# EAGLE schematic Expansion_01 (EAGLE 7.5.0)
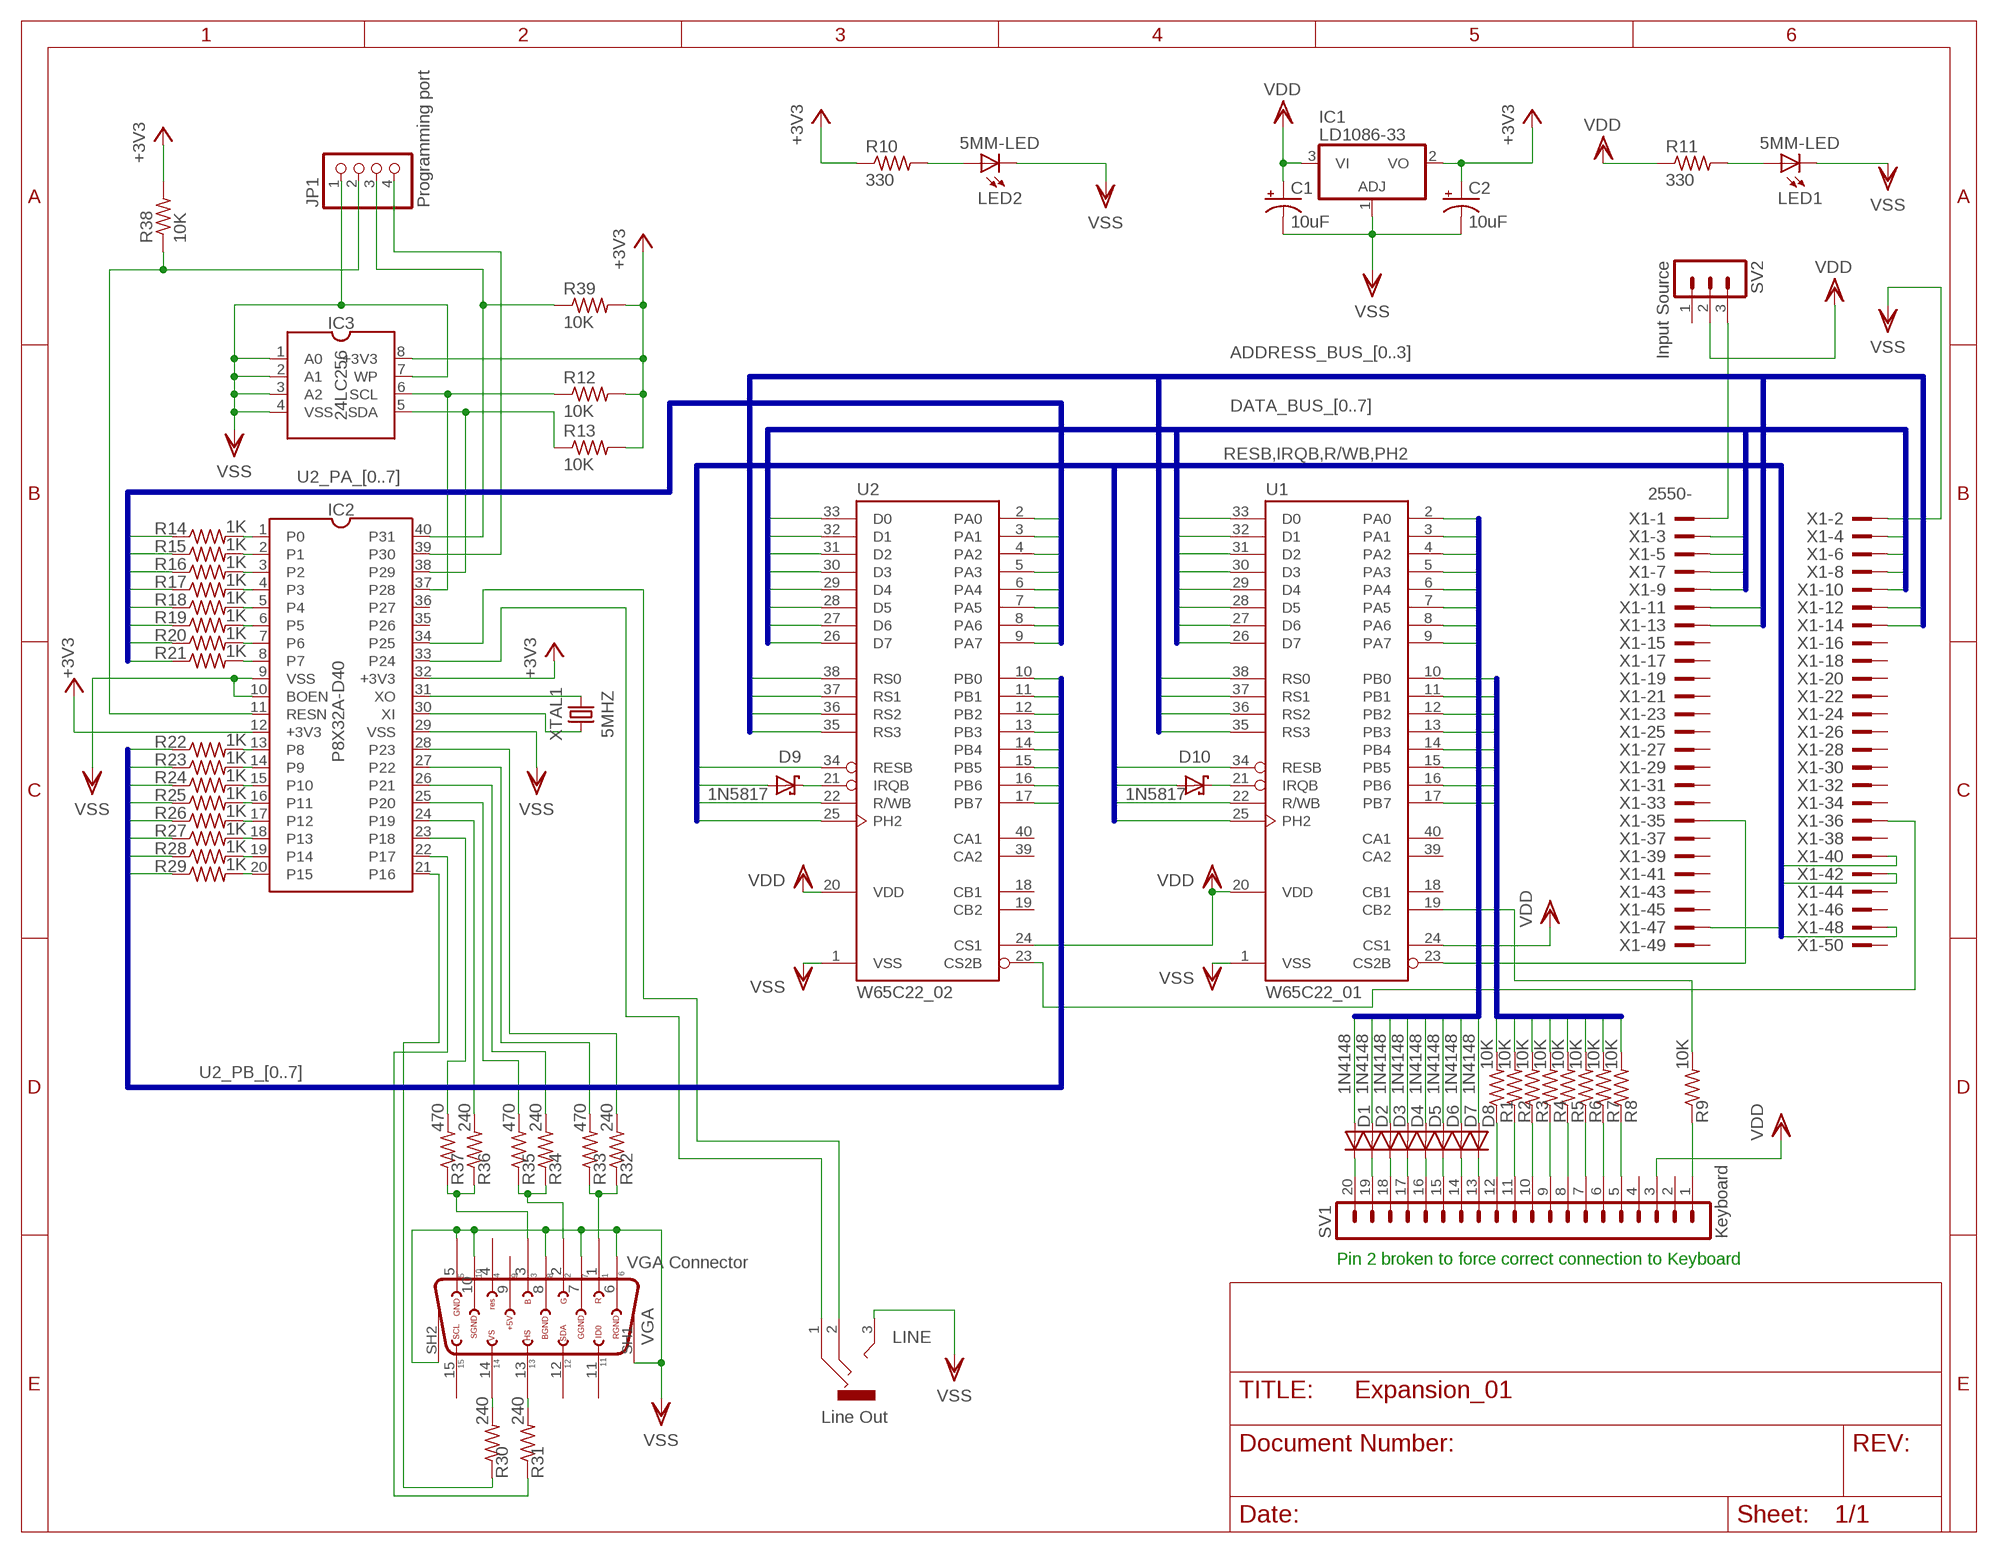
[diagram p0: schematic, sheet 1]

## Parts
C1  10uF  CPOL-USE2-5  [E2-5]
C2  10uF  CPOL-USE2-5  [E2-5]
D1  1N4148  1N4148DO35-7  [DO35-7]
D2  1N4148  1N4148DO35-7  [DO35-7]
D3  1N4148  1N4148DO35-7  [DO35-7]
D4  1N4148  1N4148DO35-7  [DO35-7]
D5  1N4148  1N4148DO35-7  [DO35-7]
D6  1N4148  1N4148DO35-7  [DO35-7]
D7  1N4148  1N4148DO35-7  [DO35-7]
D8  1N4148  1N4148DO35-7  [DO35-7]
D9  1N5817  1N5817-B  [DO41-7.6]
D10  1N5817  1N5817-B  [DO41-7.6]
IC1  LD1086-33  317T  [TO220H]
IC2  P8X32A-D40DIP-40  [P8X32A-D40]
IC3  24LC256DIP-8  [24LC256]
JP1  Programming port  PINHD-1X4/90  [1X04/90]
LED1  5MM-LED  [5MM-LED]
LED2  5MM-LED  [5MM-LED]
LINE  Line Out  1503_04  [1503_04]
R1  10K  R-US_0207/10  [0207/10]
R2  10K  R-US_0207/10  [0207/10]
R3  10K  R-US_0207/10  [0207/10]
R4  10K  R-US_0207/10  [0207/10]
R5  10K  R-US_0207/10  [0207/10]
R6  10K  R-US_0207/10  [0207/10]
R7  10K  R-US_0207/10  [0207/10]
R8  10K  R-US_0207/10  [0207/10]
R9  10K  R-US_0207/10  [0207/10]
R10  330  R-US_0207/10  [0207/10]
R11  330  R-US_0207/10  [0207/10]
R12  10K  R-US_0207/10  [0207/10]
R13  10K  R-US_0207/10  [0207/10]
R14  1K  R-US_0207/10  [0207/10]
R15  1K  R-US_0207/10  [0207/10]
R16  1K  R-US_0207/10  [0207/10]
R17  1K  R-US_0207/10  [0207/10]
R18  1K  R-US_0207/10  [0207/10]
R19  1K  R-US_0207/10  [0207/10]
R20  1K  R-US_0207/10  [0207/10]
R21  1K  R-US_0207/10  [0207/10]
R22  1K  R-US_0207/10  [0207/10]
R23  1K  R-US_0207/10  [0207/10]
R24  1K  R-US_0207/10  [0207/10]
R25  1K  R-US_0207/10  [0207/10]
R26  1K  R-US_0207/10  [0207/10]
R27  1K  R-US_0207/10  [0207/10]
R28  1K  R-US_0207/10  [0207/10]
R29  1K  R-US_0207/10  [0207/10]
R30  240  R-US_0207/10  [0207/10]
R31  240  R-US_0207/10  [0207/10]
R32  240  R-US_0207/10  [0207/10]
R33  470  R-US_0207/10  [0207/10]
R34  240  R-US_0207/10  [0207/10]
R35  470  R-US_0207/10  [0207/10]
R36  240  R-US_0207/10  [0207/10]
R37  470  R-US_0207/10  [0207/10]
R38  10K  R-US_0207/10  [0207/10]
R39  10K  R-US_0207/10  [0207/10]
SV1  Keyboard  MA20-1  [MA20-1]
SV2  Input Source  MA03-1  [MA03-1]
U1  W65C22_01  G65SC22P  [DIP-40]
U2  W65C22_02  G65SC22P  [DIP-40]
VGA  VGA Connector  VGAF  [HD15F]
X1  2550-  [PAK100/2500-50]
XTAL1  5MHZ  5MHZ-CRYSTAL  [5MHZ-CRYSTAL]

## Nets
+3V3: C2.+ IC1.2(VO) IC2.12(+3V3) IC2.32(+3V3) IC3.8(+3V3) R10.1 R12.2 R13.2 R38.2 R39.2
ADDRESS_BUS_0: U1.38(RS0) U2.38(RS0) X1.11
ADDRESS_BUS_1: U1.37(RS1) U2.37(RS1) X1.12
ADDRESS_BUS_2: U1.36(RS2) U2.36(RS2) X1.13
ADDRESS_BUS_3: U1.35(RS3) U2.35(RS3) X1.14
DATA_BUS_0: U1.33(D0) U2.33(D0) X1.3 X1.4
DATA_BUS_1: U1.32(D1) U2.32(D1)
DATA_BUS_2: U1.31(D2) U2.31(D2) X1.5
DATA_BUS_3: U1.30(D3) U2.30(D3) X1.6
DATA_BUS_4: U1.29(D4) U2.29(D4) X1.7
DATA_BUS_5: U1.28(D5) U2.28(D5) X1.8
DATA_BUS_6: U1.27(D6) U2.27(D6) X1.9
DATA_BUS_7: U1.26(D7) U2.26(D7) X1.10
IRQB: D9.A D10.A X1.40
N$1: SV2.3 X1.1
N$2: D1.C SV1.20
N$3: D2.C SV1.19
N$4: D3.C SV1.18
N$5: D4.C SV1.17
N$6: D5.C SV1.16
N$7: D6.C SV1.15
N$8: D7.C SV1.14
N$9: D8.C SV1.13
N$10: R1.1 SV1.12
N$11: R2.1 SV1.11
N$12: R3.1 SV1.10
N$13: R4.1 SV1.9
N$14: R5.1 SV1.8
N$15: R6.1 SV1.7
N$16: R7.1 SV1.6
N$17: R8.1 SV1.5
N$18: R9.1 SV1.1
N$19: R9.2 U1.19(CB2)
N$20: D10.C U1.21(IRQB)
N$21: D9.C U2.21(IRQB)
N$22: U1.23(CS2B) X1.35
N$23: U2.23(CS2B) X1.36
N$24: LED1.A R11.2
N$25: LED2.A R10.2
N$26: IC2.40(P31) JP1.3 R39.1
N$27: IC2.39(P30) JP1.4
N$28: IC2.31(XO) XTAL1.2
N$29: IC2.30(XI) XTAL1.1
N$30: IC2.11(RESN) JP1.2 R38.1
N$31: IC2.38(P29) IC3.5(SDA) R13.1
N$32: IC2.37(P28) IC3.6(SCL) R12.1
N$33: IC2.1(P0) R14.2
N$34: IC2.2(P1) R15.2
N$35: IC2.3(P2) R16.2
N$36: IC2.4(P3) R17.2
N$37: IC2.5(P4) R18.2
N$38: IC2.6(P5) R19.2
N$39: IC2.7(P6) R20.2
N$40: IC2.8(P7) R21.2
N$41: IC2.13(P8) R22.2
N$42: IC2.14(P9) R23.2
N$43: IC2.15(P10) R24.2
N$44: IC2.16(P11) R25.2
N$45: IC2.17(P12) R26.2
N$46: IC2.18(P13) R27.2
N$47: IC2.19(P14) R28.2
N$48: IC2.20(P15) R29.2
N$49: R32.1 R33.1 VGA.1
N$50: R34.1 R35.1 VGA.2
N$51: R36.1 R37.1 VGA.3
N$52: IC2.23(P18) R37.2
N$53: IC2.22(P17) R31.1
N$54: R30.2 VGA.14
N$55: R31.2 VGA.13
N$56: IC2.21(P16) R30.1
N$57: IC2.24(P19) R36.2
N$58: IC2.25(P20) R35.2
N$59: IC2.26(P21) R34.2
N$60: IC2.27(P22) R33.2
N$61: IC2.28(P23) R32.2
N$62: IC2.33(P24) LINE.1
N$63: IC2.34(P25) LINE.2
PH2: U1.25(PH2) U2.25(PH2) X1.48
R/WB: U1.22(R/WB) U2.22(R/WB) X1.47
RESB: U1.34(RESB) U2.34(RESB) X1.42
U1_PA_0: D1.A U1.2(PA0)
U1_PA_1: D2.A U1.3(PA1)
U1_PA_2: D3.A U1.4(PA2)
U1_PA_3: D4.A U1.5(PA3)
U1_PA_4: D5.A U1.6(PA4)
U1_PA_5: D6.A U1.7(PA5)
U1_PA_6: D7.A U1.8(PA6)
U1_PA_7: D8.A U1.9(PA7)
U1_PB_0: R1.2 U1.10(PB0)
U1_PB_1: R2.2 U1.11(PB1)
U1_PB_2: R3.2 U1.12(PB2)
U1_PB_3: R4.2 U1.13(PB3)
U1_PB_4: R5.2 U1.14(PB4)
U1_PB_5: R6.2 U1.15(PB5)
U1_PB_6: R7.2 U1.16(PB6)
U1_PB_7: R8.2 U1.17(PB7)
U2_PA_0: R14.1 U2.2(PA0)
U2_PA_1: R15.1 U2.3(PA1)
U2_PA_2: R16.1 U2.4(PA2)
U2_PA_3: R17.1 U2.5(PA3)
U2_PA_4: R18.1 U2.6(PA4)
U2_PA_5: R19.1 U2.7(PA5)
U2_PA_6: R20.1 U2.8(PA6)
U2_PA_7: R21.1 U2.9(PA7)
U2_PB_0: R22.1 U2.10(PB0)
U2_PB_1: R23.1 U2.11(PB1)
U2_PB_2: R24.1 U2.12(PB2)
U2_PB_3: R25.1 U2.13(PB3)
U2_PB_4: R26.1 U2.14(PB4)
U2_PB_5: R27.1 U2.15(PB5)
U2_PB_6: R28.1 U2.16(PB6)
U2_PB_7: R29.1 U2.17(PB7)
VDD: C1.+ IC1.3(VI) R11.1 SV1.3 SV2.2 U1.20(VDD) U1.24(CS1) U2.20(VDD) U2.24(CS1)
VSS: C1.- C2.- IC1.1(ADJ) IC2.9(VSS) IC2.10(BOEN) IC2.29(VSS) IC3.1(A0) IC3.2(A1) IC3.3(A2) IC3.4(VSS) IC3.7(WP) JP1.1 LED1.K(C) LED2.K(C) LINE.3 U1.1(VSS) U2.1(VSS) VGA.5 VGA.6 VGA.7 VGA.8 VGA.10 VGA.SH1 VGA.SH2 X1.2
Unconnected: IC2.35(P26) IC2.36(P27) SV1.2 SV1.4 SV2.1 U1.18(CB1) U1.39(CA2) U1.40(CA1) U2.18(CB1) U2.19(CB2) U2.39(CA2) U2.40(CA1) VGA.4 VGA.9 VGA.11 VGA.12 VGA.15 X1.15 X1.16 X1.17 X1.18 X1.19 X1.20 X1.21 X1.22 X1.23 X1.24 X1.25 X1.26 X1.27 X1.28 X1.29 X1.30 X1.31 X1.32 X1.33 X1.34 X1.37 X1.38 X1.39 X1.41 X1.43 X1.44 X1.45 X1.46 X1.49 X1.50

## Buses
DATA_BUS_[0..7]
ADDRESS_BUS_[0..3]
U1_PA_[0..7]
U1_PB_[0..7]
RESB,IRQB,R/WB,PH2
U2_PA_[0..7]
U2_PB_[0..7]

## Notes on the sheet
- Pin 2 broken to force correct connection to Keyboard

## Library data of the parts
C1 C2 = rcl:CPOL-US: POLARIZED CAPACITOR, American symbol
D1-D8 = diode:1N4148: DIODE high speed (Philips)
D9 D10 = diode:1N581*: 1.0A SCHOTTKY BARRIER RECTIFIER Source: http://www.diodes.com/datasheets/ds23001.pdf
IC1 = linear:*317: Positive VOLTAGE REGULATOR
IC2 = propeller-dip-plus:P8X32A-D40: Parallax Propeller P8X32A-D40 Microcontroller DIP40
IC3 = propeller-dip-plus:24LC256: 256 Kbit (32 KByte) Industrial I2C Serial EEPROM
JP1 = pinhead:PINHD-1X4: PIN HEADER
LED1 LED2 = propeller-dip-plus:5MM-LED: Green 5MM LED (T-1 3/4)
LINE = con-lumberg:1503_04: Jack connectors according to JISC 6560, 3.5 mm, IP 57 Klinkensteckverbinder nach JISC 6560, 3,5 mm, IP 57 Source: http://www.lumberg.com/Produkte/PDFs/1503_04.pdf; OC_FARNELL: 1216981; OC_NEWARK: unknown
R1-R39 = resistor:R-US_: RESISTOR, American symbol
SV1 = con-lstb:MA20-1: PIN HEADER; OC_FARNELL: unknown; OC_NEWARK: unknown
SV2 = con-lstb:MA03-1: PIN HEADER; OC_FARNELL: unknown; OC_NEWARK: unknown
U1 U2 = 65xxx:G65SC22P: California Micro Devices Version
VGA = HD15_B:VGAF
X1 = con-3m:2550-: 3M (TM) Pak 100 4-Wall Header Source: 3M; OC_FARNELL: unknown; OC_NEWARK: unknown
XTAL1 = propeller-dip-plus:5MHZ-CRYSTAL: HC-49US 5MHz Quartz Crystal